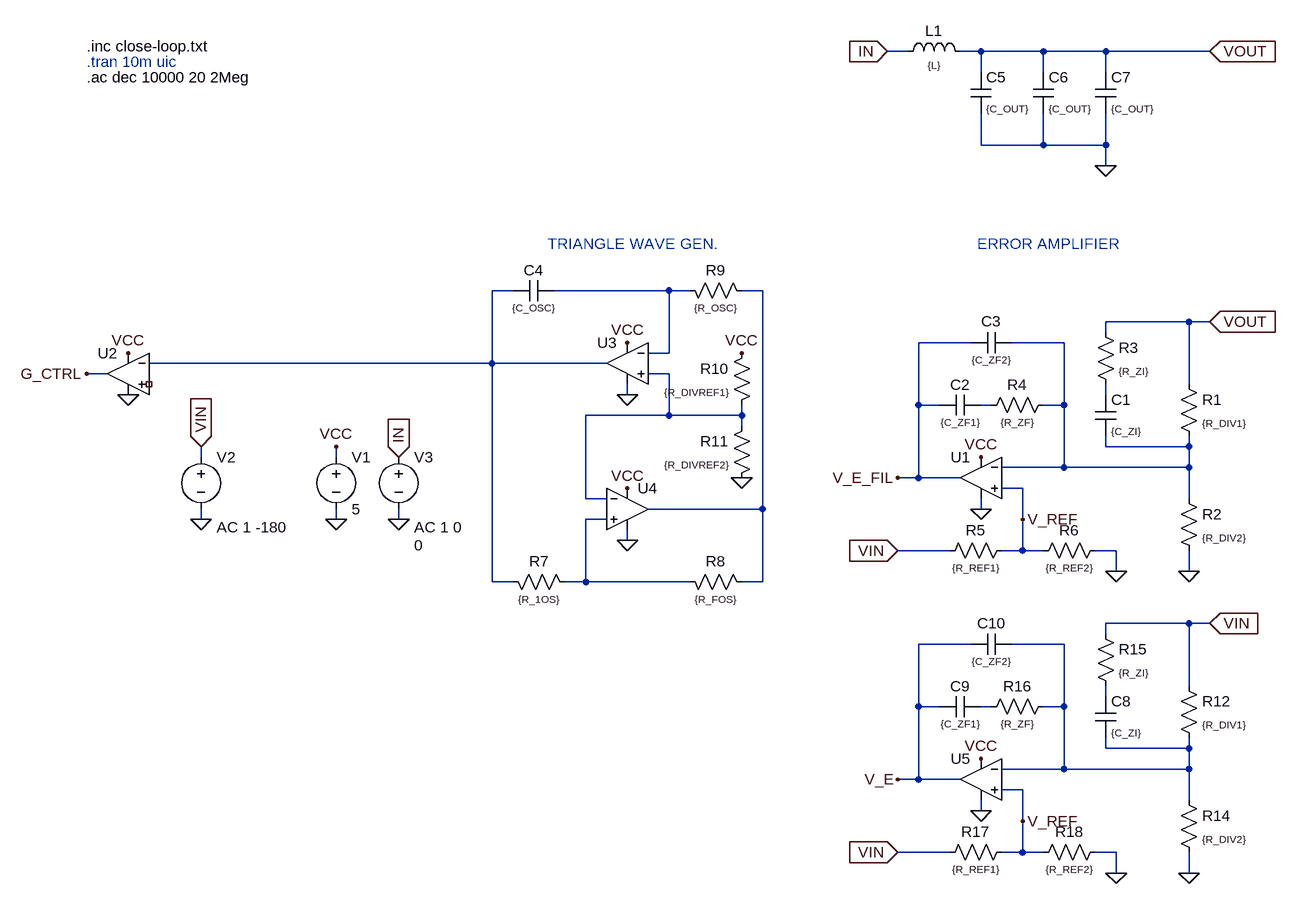
[diagram p0: schematic feedback.asc]
feedback.asc, the LTspice schematic file:
Version 4
SHEET 1 1096 808
WIRE 416 -496 384 -496
WIRE 528 -496 496 -496
WIRE 624 -496 528 -496
WIRE 720 -496 624 -496
WIRE 880 -496 720 -496
WIRE 528 -464 528 -496
WIRE 624 -464 624 -496
WIRE 720 -464 720 -496
WIRE 528 -352 528 -400
WIRE 624 -352 624 -400
WIRE 624 -352 528 -352
WIRE 720 -352 720 -400
WIRE 720 -352 624 -352
WIRE 720 -320 720 -352
WIRE -192 -128 -224 -128
WIRE 48 -128 -128 -128
WIRE 80 -128 48 -128
WIRE 192 -128 160 -128
WIRE 848 -80 720 -80
WIRE 880 -80 848 -80
WIRE 720 -64 720 -80
WIRE 512 -48 432 -48
WIRE 656 -48 576 -48
WIRE 48 -32 48 -128
WIRE 48 -32 16 -32
WIRE -224 -16 -224 -128
WIRE -224 -16 -752 -16
WIRE -48 -16 -224 -16
WIRE -816 0 -848 0
WIRE 48 0 16 0
WIRE 848 16 848 -80
WIRE -16 32 -16 16
WIRE 720 32 720 16
WIRE 432 48 432 -48
WIRE 464 48 432 48
WIRE 544 48 528 48
WIRE 656 48 656 -48
WIRE 656 48 624 48
WIRE 48 64 48 0
WIRE 48 64 -80 64
WIRE 160 64 160 48
WIRE 160 64 48 64
WIRE 160 80 160 64
WIRE 720 112 720 96
WIRE 848 112 848 96
WIRE 848 112 720 112
WIRE -672 128 -672 112
WIRE -464 128 -464 112
WIRE 656 144 656 48
WIRE 656 144 560 144
WIRE 848 144 848 112
WIRE 848 144 656 144
WIRE 432 160 432 48
WIRE 432 160 400 160
WIRE 496 160 432 160
WIRE 592 176 560 176
WIRE -80 192 -80 64
WIRE -48 192 -80 192
WIRE 848 192 848 144
WIRE 192 208 192 -128
WIRE 192 208 16 208
WIRE 528 208 528 192
WIRE -672 224 -672 208
WIRE -464 224 -464 208
WIRE -368 224 -368 208
WIRE -48 224 -80 224
WIRE 592 224 592 176
WIRE -16 256 -16 240
WIRE 480 272 400 272
WIRE 592 272 592 224
WIRE 592 272 560 272
WIRE 624 272 592 272
WIRE 736 272 704 272
WIRE 736 304 736 272
WIRE 848 304 848 272
WIRE -224 320 -224 -16
WIRE -192 320 -224 320
WIRE -80 320 -80 224
WIRE -80 320 -112 320
WIRE 80 320 -80 320
WIRE 192 320 192 208
WIRE 192 320 160 320
WIRE 848 384 720 384
WIRE 880 384 848 384
WIRE 720 400 720 384
WIRE 512 416 432 416
WIRE 656 416 576 416
WIRE 848 480 848 384
WIRE 720 496 720 480
WIRE 432 512 432 416
WIRE 464 512 432 512
WIRE 544 512 528 512
WIRE 656 512 656 416
WIRE 656 512 624 512
WIRE 720 576 720 560
WIRE 848 576 848 560
WIRE 848 576 720 576
WIRE 656 608 656 512
WIRE 656 608 560 608
WIRE 848 608 848 576
WIRE 848 608 656 608
WIRE 432 624 432 512
WIRE 432 624 400 624
WIRE 496 624 432 624
WIRE 592 640 560 640
WIRE 848 656 848 608
WIRE 528 672 528 656
WIRE 592 688 592 640
WIRE 480 736 400 736
WIRE 592 736 592 688
WIRE 592 736 560 736
WIRE 624 736 592 736
WIRE 736 736 704 736
WIRE 736 768 736 736
WIRE 848 768 848 736
FLAG 848 304 0
FLAG 400 160 V_E_FIL
FLAG 880 -80 VOUT
IOPIN 880 -80 In
FLAG 528 208 0
FLAG -16 -48 VCC
FLAG -16 176 VCC
FLAG 160 -32 VCC
FLAG 160 160 0
FLAG -16 32 0
FLAG -16 256 0
FLAG -848 0 G_CTRL
FLAG -784 -32 VCC
FLAG -784 32 0
FLAG 528 128 VCC
FLAG 736 304 0
FLAG 400 272 VIN
IOPIN 400 272 In
FLAG 592 224 V_REF
FLAG -464 112 VCC
FLAG -464 224 0
FLAG -368 224 0
FLAG -368 128 IN
IOPIN -368 128 In
FLAG 384 -496 IN
IOPIN 384 -496 In
FLAG 880 -496 VOUT
IOPIN 880 -496 In
FLAG 720 -320 0
FLAG -672 112 VIN
IOPIN -672 112 In
FLAG -672 224 0
FLAG 848 768 0
FLAG 400 624 V_E
FLAG 528 672 0
FLAG 528 592 VCC
FLAG 736 768 0
FLAG 400 736 VIN
IOPIN 400 736 In
FLAG 592 688 V_REF
FLAG 880 384 VIN
IOPIN 880 384 In
SYMBOL OpAmps\\UniversalOpAmp2 528 160 M0
SYMATTR InstName U1
SYMBOL OpAmps\\UniversalOpAmp2 -784 0 M0
SYMATTR InstName U2
SYMBOL OpAmps\\UniversalOpAmp2 -16 -16 M0
SYMATTR InstName U3
SYMBOL OpAmps\\UniversalOpAmp2 -16 208 R0
SYMATTR InstName U4
SYMBOL res 832 0 R0
WINDOW 3 36 76 Left 1
SYMATTR Value {R_DIV1}
SYMATTR InstName R1
SYMBOL res 832 176 R0
WINDOW 3 36 76 Left 1
SYMATTR Value {R_DIV2}
SYMATTR InstName R2
SYMBOL res 704 -80 R0
WINDOW 3 36 76 Left 1
SYMATTR Value {R_ZI}
SYMATTR InstName R3
SYMBOL cap 704 32 R0
WINDOW 3 24 56 Left 1
SYMATTR Value {C_ZI}
SYMATTR InstName C1
SYMBOL res 640 32 R90
WINDOW 0 0 56 VBottom 2
WINDOW 3 32 56 VTop 1
SYMATTR InstName R4
SYMATTR Value {R_ZF}
SYMBOL cap 528 32 R90
WINDOW 0 0 32 VBottom 2
WINDOW 3 32 32 VTop 1
SYMATTR InstName C2
SYMATTR Value {C_ZF1}
SYMBOL cap 576 -64 R90
WINDOW 0 -1 32 VBottom 2
WINDOW 3 32 32 VTop 1
SYMATTR InstName C3
SYMATTR Value {C_ZF2}
SYMBOL res 576 256 R90
WINDOW 0 0 56 VBottom 2
WINDOW 3 32 56 VTop 1
SYMATTR InstName R5
SYMATTR Value {R_REF1}
SYMBOL res 720 256 R90
WINDOW 0 0 56 VBottom 2
WINDOW 3 32 56 VTop 1
SYMATTR InstName R6
SYMATTR Value {R_REF2}
SYMBOL res -208 304 M90
WINDOW 0 0 56 VBottom 2
WINDOW 3 32 56 VTop 1
SYMATTR InstName R7
SYMATTR Value {R_1OS}
SYMBOL res 64 304 M90
WINDOW 0 0 56 VBottom 2
WINDOW 3 32 56 VTop 1
SYMATTR InstName R8
SYMATTR Value {R_FOS}
SYMBOL res 64 -144 M90
WINDOW 0 0 56 VBottom 2
WINDOW 3 32 56 VTop 1
SYMATTR InstName R9
SYMATTR Value {R_OSC}
SYMBOL cap -192 -144 M90
WINDOW 0 0 32 VBottom 2
WINDOW 3 32 32 VTop 1
SYMATTR InstName C4
SYMATTR Value {C_OSC}
SYMBOL res 176 -48 M0
WINDOW 3 36 76 Left 1
SYMATTR Value {R_DIVREF1}
SYMATTR InstName R10
SYMBOL res 176 64 M0
WINDOW 3 36 76 Left 1
SYMATTR Value {R_DIVREF2}
SYMATTR InstName R11
SYMBOL voltage -464 112 R0
SYMATTR InstName V1
SYMATTR Value 5
SYMBOL voltage -368 112 R0
WINDOW 3 24 152 Left 2
WINDOW 123 24 124 Left 2
WINDOW 39 0 0 Left 0
SYMATTR InstName V3
SYMATTR Value 0
SYMATTR Value2 AC 1 0
SYMBOL ind 400 -480 R270
WINDOW 0 32 56 VTop 2
WINDOW 3 5 56 VBottom 1
SYMATTR InstName L1
SYMATTR Value {L}
SYMBOL cap 512 -464 R0
WINDOW 3 24 56 Left 1
SYMATTR Value {C_OUT}
SYMATTR InstName C5
SYMBOL cap 608 -464 R0
WINDOW 3 24 56 Left 1
SYMATTR Value {C_OUT}
SYMATTR InstName C6
SYMBOL cap 704 -464 R0
WINDOW 3 24 56 Left 1
SYMATTR Value {C_OUT}
SYMATTR InstName C7
SYMBOL voltage -672 112 R0
WINDOW 123 24 124 Left 2
WINDOW 39 0 0 Left 0
SYMATTR InstName V2
SYMATTR Value ""
SYMATTR Value2 AC 1 -180
SYMBOL OpAmps\\UniversalOpAmp2 528 624 M0
SYMATTR InstName U5
SYMBOL res 832 464 R0
WINDOW 3 36 76 Left 1
SYMATTR Value {R_DIV1}
SYMATTR InstName R12
SYMBOL res 832 640 R0
WINDOW 3 36 76 Left 1
SYMATTR Value {R_DIV2}
SYMATTR InstName R14
SYMBOL res 704 384 R0
WINDOW 3 36 76 Left 1
SYMATTR Value {R_ZI}
SYMATTR InstName R15
SYMBOL cap 704 496 R0
WINDOW 3 24 56 Left 1
SYMATTR Value {C_ZI}
SYMATTR InstName C8
SYMBOL res 640 496 R90
WINDOW 0 0 56 VBottom 2
WINDOW 3 32 56 VTop 1
SYMATTR InstName R16
SYMATTR Value {R_ZF}
SYMBOL cap 528 496 R90
WINDOW 0 0 32 VBottom 2
WINDOW 3 32 32 VTop 1
SYMATTR InstName C9
SYMATTR Value {C_ZF1}
SYMBOL cap 576 400 R90
WINDOW 0 -1 32 VBottom 2
WINDOW 3 32 32 VTop 1
SYMATTR InstName C10
SYMATTR Value {C_ZF2}
SYMBOL res 576 720 R90
WINDOW 0 0 56 VBottom 2
WINDOW 3 32 56 VTop 1
SYMATTR InstName R17
SYMATTR Value {R_REF1}
SYMBOL res 720 720 R90
WINDOW 0 0 56 VBottom 2
WINDOW 3 32 56 VTop 1
SYMATTR InstName R18
SYMATTR Value {R_REF2}
TEXT -8 -200 Center 2 ;TRIANGLE WAVE GEN.
TEXT 632 -200 Center 2 ;ERROR AMPLIFIER
TEXT -848 -504 Left 2 !.inc close-loop.txt
TEXT -848 -480 Left 2 ;.tran 10m uic
TEXT -848 -456 Left 2 !.ac dec 10000 20 2Meg

The netlist it stands for:
* feedback.asc
XU1 V_REF N004 VCC 0 V_E_FIL level2 Avol=1Meg GBW=10Meg Slew=10Meg Ilimit=25m Rail=0 Vos=0 En=0 Enk=0 In=0 Ink=0 Rin=500Meg  ; pins In+ In- V+ V- OUT
XU2 NC_01 N001 VCC 0 G_CTRL level2 Avol=1Meg GBW=10Meg Slew=10Meg Ilimit=25m Rail=0 Vos=0 En=0 Enk=0 In=0 Ink=0 Rin=500Meg  ; pins In+ In- V+ V- OUT
XU3 N005 N002 VCC 0 N001 level2 Avol=1Meg GBW=10Meg Slew=10Meg Ilimit=25m Rail=0 Vos=0 En=0 Enk=0 In=0 Ink=0 Rin=500Meg  ; pins In+ In- V+ V- OUT
XU4 N008 N005 VCC 0 N003 level2 Avol=1Meg GBW=10Meg Slew=10Meg Ilimit=25m Rail=0 Vos=0 En=0 Enk=0 In=0 Ink=0 Rin=500Meg  ; pins In+ In- V+ V- OUT
R1 VOUT N004 {R_DIV1}
R2 N004 0 {R_DIV2}
R3 VOUT N006 {R_ZI}
C1 N006 N004 {C_ZI}
R4 N004 N007 {R_ZF}
C2 N007 V_E_FIL {C_ZF1}
C3 N004 V_E_FIL {C_ZF2}
R5 V_REF VIN {R_REF1}
R6 0 V_REF {R_REF2}
R7 N001 N008 {R_1OS}
R8 N008 N003 {R_FOS}
R9 N002 N003 {R_OSC}
C4 N001 N002 {C_OSC}
R10 VCC N005 {R_DIVREF1}
R11 N005 0 {R_DIVREF2}
V1 VCC 0 5
V3 IN 0 0 AC 1 0
L1 IN VOUT {L}
C5 VOUT 0 {C_OUT}
C6 VOUT 0 {C_OUT}
C7 VOUT 0 {C_OUT}
V2 VIN 0 AC 1 -180
XU5 V_REF N009 VCC 0 V_E level2 Avol=1Meg GBW=10Meg Slew=10Meg Ilimit=25m Rail=0 Vos=0 En=0 Enk=0 In=0 Ink=0 Rin=500Meg  ; pins In+ In- V+ V- OUT
R12 VIN N009 {R_DIV1}
R14 N009 0 {R_DIV2}
R15 VIN N010 {R_ZI}
C8 N010 N009 {C_ZI}
R16 N009 N011 {R_ZF}
C9 N011 V_E {C_ZF1}
C10 N009 V_E {C_ZF2}
R17 V_REF VIN {R_REF1}
R18 0 V_REF {R_REF2}
* TRIANGLE WAVE GEN.
* ERROR AMPLIFIER
.inc close-loop.txt
* .tran 10m uic
.ac dec 10000 20 2Meg
.lib UniversalOpAmp2.lib
.backanno
.end